# Altium schematic sheet Connectors2.SchDoc
size A4
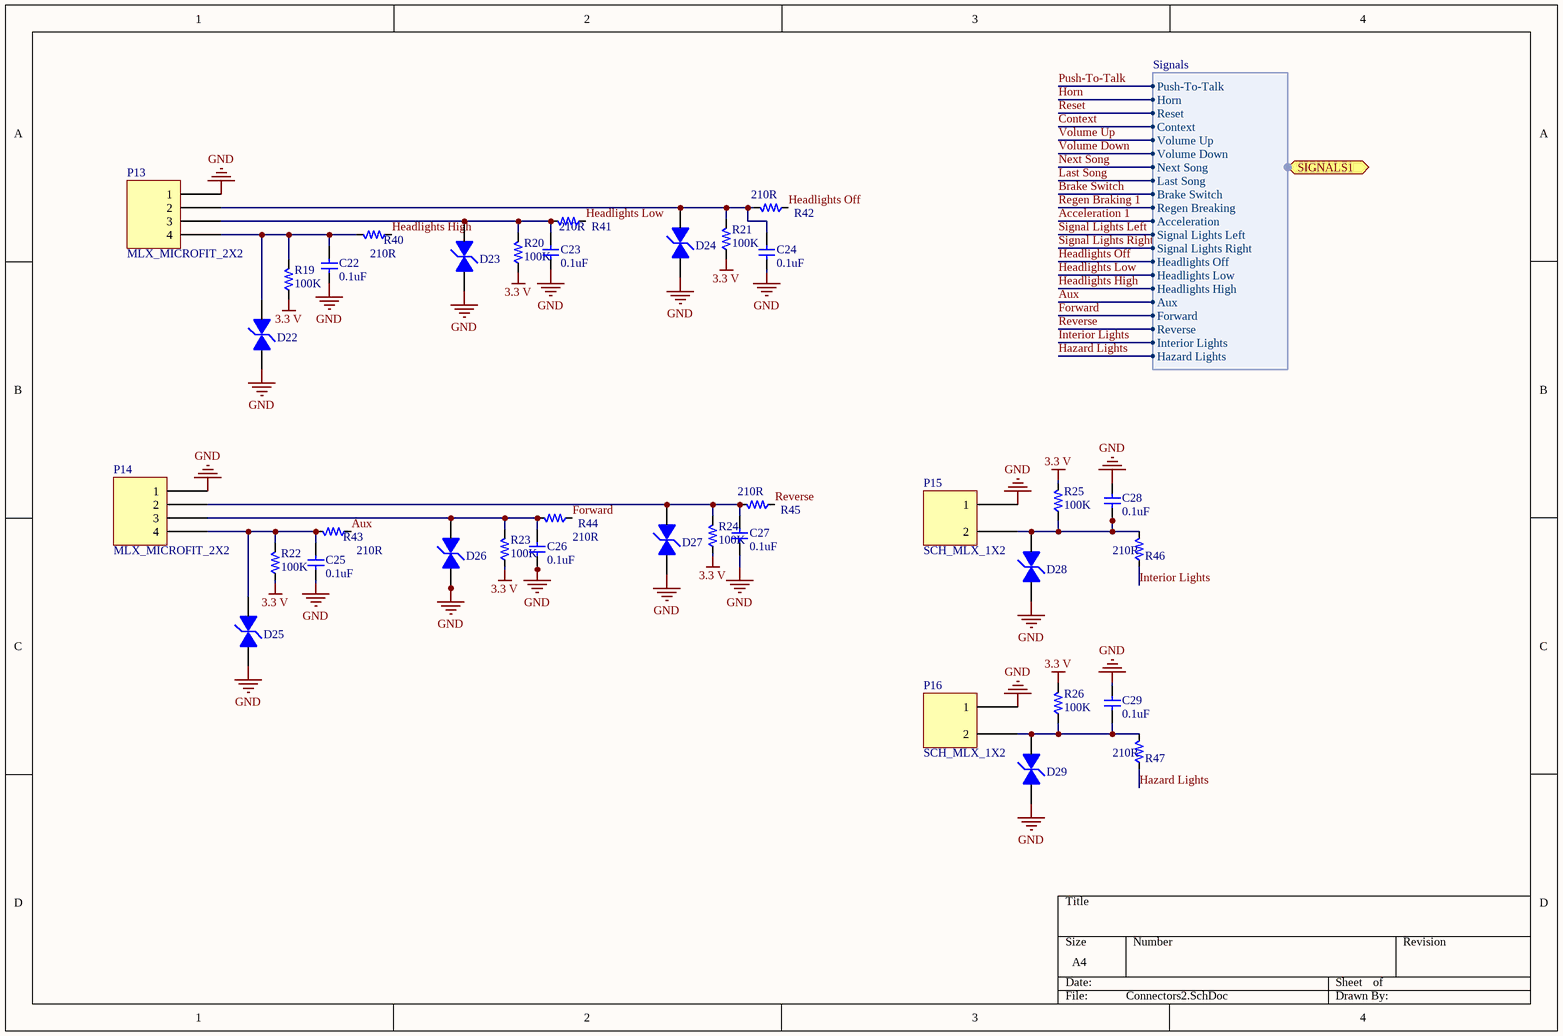
[diagram p0: Connectors2.SchDoc]

## Parts
C22  value 0.1uF  [PCB_GENERIC_SMD_0603]  (hidden comment: C060-000U1-00)
C23  value 0.1uF  [PCB_GENERIC_SMD_0603]  (hidden comment: C060-000U1-00)
C24  value 0.1uF  [PCB_GENERIC_SMD_0603]  (hidden comment: C060-000U1-00)
C25  value 0.1uF  [PCB_GENERIC_SMD_0603]  (hidden comment: C060-000U1-00)
C26  value 0.1uF  [PCB_GENERIC_SMD_0603]  (hidden comment: C060-000U1-00)
C27  value 0.1uF  [PCB_GENERIC_SMD_0603]  (hidden comment: C060-000U1-00)
C28  value 0.1uF  [PCB_GENERIC_SMD_0603]  (hidden comment: C060-000U1-00)
C29  value 0.1uF  [PCB_GENERIC_SMD_0603]  (hidden comment: C060-000U1-00)
D22  TVS Diode  [TVS Diode]  (value not drawn)
D23  TVS Diode  [TVS Diode]  (value not drawn)
D24  TVS Diode  [TVS Diode]  (value not drawn)
D25  TVS Diode  [TVS Diode]  (value not drawn)
D26  TVS Diode  [TVS Diode]  (value not drawn)
D27  TVS Diode  [TVS Diode]  (value not drawn)
D28  TVS Diode  [TVS Diode]  (value not drawn)
D29  TVS Diode  [TVS Diode]  (value not drawn)
P13  MLX_MICROFIT_2X2  [MLX_MICROFIT_2X2]
P14  MLX_MICROFIT_2X2  [MLX_MICROFIT_2X2]
P15  SCH_MLX_1X2  [PCB_MLX_MICROFIT_1X2]
P16  SCH_MLX_1X2  [PCB_MLX_MICROFIT_1X2]
R19  value 100K  [PCB_GENERIC_SMD_0603]  (hidden comment: R060-00104-05)
R20  value 100K  [PCB_GENERIC_SMD_0603]  (hidden comment: R060-00104-05)
R21  value 100K  [PCB_GENERIC_SMD_0603]  (hidden comment: R060-00104-05)
R22  value 100K  [PCB_GENERIC_SMD_0603]  (hidden comment: R060-00104-05)
R23  value 100K  [PCB_GENERIC_SMD_0603]  (hidden comment: R060-00104-05)
R24  value 100K  [PCB_GENERIC_SMD_0603]  (hidden comment: R060-00104-05)
R25  value 100K  [PCB_GENERIC_SMD_0603]  (hidden comment: R060-00104-05)
R26  value 100K  [PCB_GENERIC_SMD_0603]  (hidden comment: R060-00104-05)
R40  Resistance: 210R  [PCB_GENERIC_SMD_0603]  (hidden comment: SCH_GENERIC_RESISTOR_0603)
R41  Resistance: 210R  [PCB_GENERIC_SMD_0603]  (hidden comment: SCH_GENERIC_RESISTOR_0603)
R42  Resistance: 210R  [PCB_GENERIC_SMD_0603]  (hidden comment: SCH_GENERIC_RESISTOR_0603)
R43  Resistance: 210R  [PCB_GENERIC_SMD_0603]  (hidden comment: SCH_GENERIC_RESISTOR_0603)
R44  Resistance: 210R  [PCB_GENERIC_SMD_0603]  (hidden comment: SCH_GENERIC_RESISTOR_0603)
R45  Resistance: 210R  [PCB_GENERIC_SMD_0603]  (hidden comment: SCH_GENERIC_RESISTOR_0603)
R46  Resistance: 210R  [PCB_GENERIC_SMD_0603]  (hidden comment: SCH_GENERIC_RESISTOR_0603)
R47  Resistance: 210R  [PCB_GENERIC_SMD_0603]  (hidden comment: SCH_GENERIC_RESISTOR_0603)

## Ports
SIGNALS1 (harness Signals)

## Harnesses
Signals: Push-To-Talk, Horn, Reset, Context, Volume Up, Volume Down, Next Song, Last Song, Brake Switch, Regen Breaking, Acceleration, Signal Lights Left, Signal Lights Right, Headlights Off, Headlights Low, Headlights High, Aux, Forward, Reverse, Interior Lights, Hazard Lights

## Nets
3.3 V: R22.1 R23.1 R24.1 R25.2
GND: C24.1 C25.1 C26.1 C27.1 C29.2 D22.2 D23.2 D24.2 D25.2 D26.2 D27.2 D28.2 D29.2 P13.1 P14.1 P15.1 P16.1
Acceleration 1: port SIGNALS1.Acceleration
Aux: R43.1 ; port SIGNALS1.Aux
Brake Switch: port SIGNALS1.Brake Switch
Context: port SIGNALS1.Context
Forward: R44.1 ; port SIGNALS1.Forward
Hazard Lights: R47.1 ; port SIGNALS1.Hazard Lights
Headlights High: R40.1 ; port SIGNALS1.Headlights High
Headlights Low: R41.1 ; port SIGNALS1.Headlights Low
Headlights Off: R42.1 ; port SIGNALS1.Headlights Off
Horn: port SIGNALS1.Horn
Interior Lights: R46.1 ; port SIGNALS1.Interior Lights
Last Song: port SIGNALS1.Last Song
Next Song: port SIGNALS1.Next Song
Push-To-Talk: port SIGNALS1.Push-To-Talk
Regen Braking 1: port SIGNALS1.Regen Breaking
Reset: port SIGNALS1.Reset
Reverse: R45.1 ; port SIGNALS1.Reverse
Signal Lights Left: port SIGNALS1.Signal Lights Left
Signal Lights Right: port SIGNALS1.Signal Lights Right
Volume Down: port SIGNALS1.Volume Down
Volume Up: port SIGNALS1.Volume Up
NetC22_2: C22.2 D22.1 P13.4 R19.2 R40.2
NetC23_2: C23.2 D23.1 P13.3 R20.2 R41.2
NetC24_2: C24.2 D24.1 P13.2 R21.2 R42.2
NetC25_2: C25.2 D25.1 P14.4 R22.2 R43.2
NetC26_2: C26.2 D26.1 P14.3 R23.2 R44.2
NetC27_2: C27.2 D27.1 P14.2 R24.2 R45.2
NetC28_1: C28.1 D28.1 P15.2 R25.1 R46.2
NetC29_1: C29.1 D29.1 P16.2 R26.1 R47.2

Not connected (* = marked no-connect by the designer): C22 1; C23 1; C28 2; R19 1; R20 1; R21 1; R26 2

## Notes on the sheet
- Labels drawn without touching a wire or pin: 3.3 V, GND

## Library data of the parts
C22-C29 = C060-000U1-00: CAP CER 0603 0.1uF 16V X5R 20%; Tolerance: 20%; Voltage: 16V; Package: 0603
D22-D29 = TVS Diode: Manufacturer: Bourns; Manufacturer ID: CDSOD323-T03SC
R19-R26 = R060-00104-05: RES 0603 100K 5% 63mW; Tolerance: 5%; Power: 63mW; Package: 0603
R40-R47 = SCH_GENERIC_RESISTOR_0603: Generic SMD resistor 0603